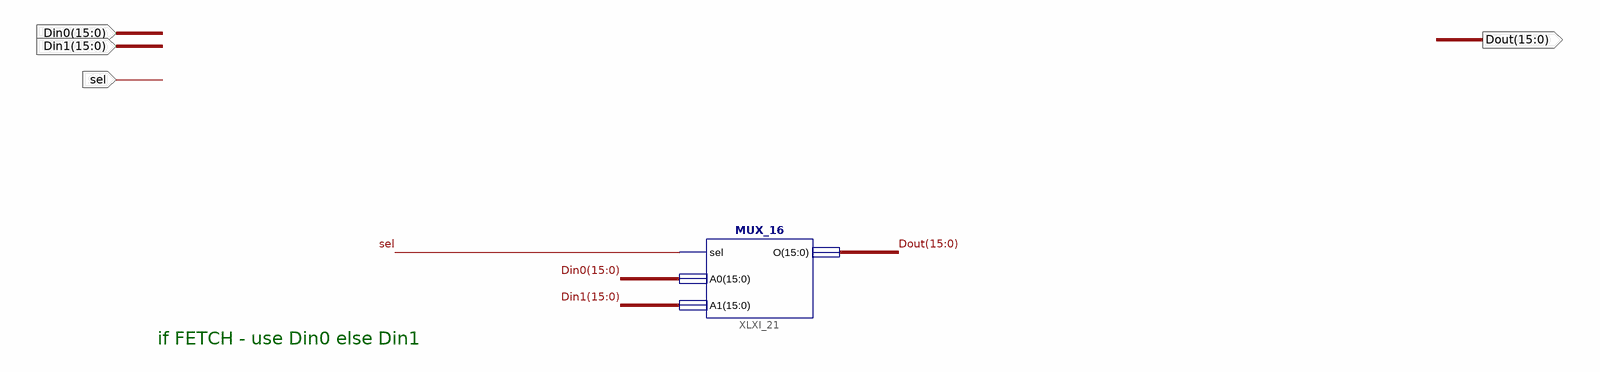
[diagram p0: schematic sheet 1]
// Xilinx ISE schematic Address_MUX.sch (spartan6) as structural Verilog: 1 symbols, 4 ports
module Address_MUX (
  input  [15:0] Din1,
  input  [15:0] Din0,
  input  sel,
  output [15:0] Dout
);

  MUX_16 XLXI_21 (.sel(sel), .A0(Din0), .A1(Din1), .O(Dout));

  // Notes on the sheet:
  //   if FETCH - use Din0 else Din1
endmodule
